# EAGLE design MKRZero_V5.0 (EAGLE 9.3.0)

## Sheet 1 of 2
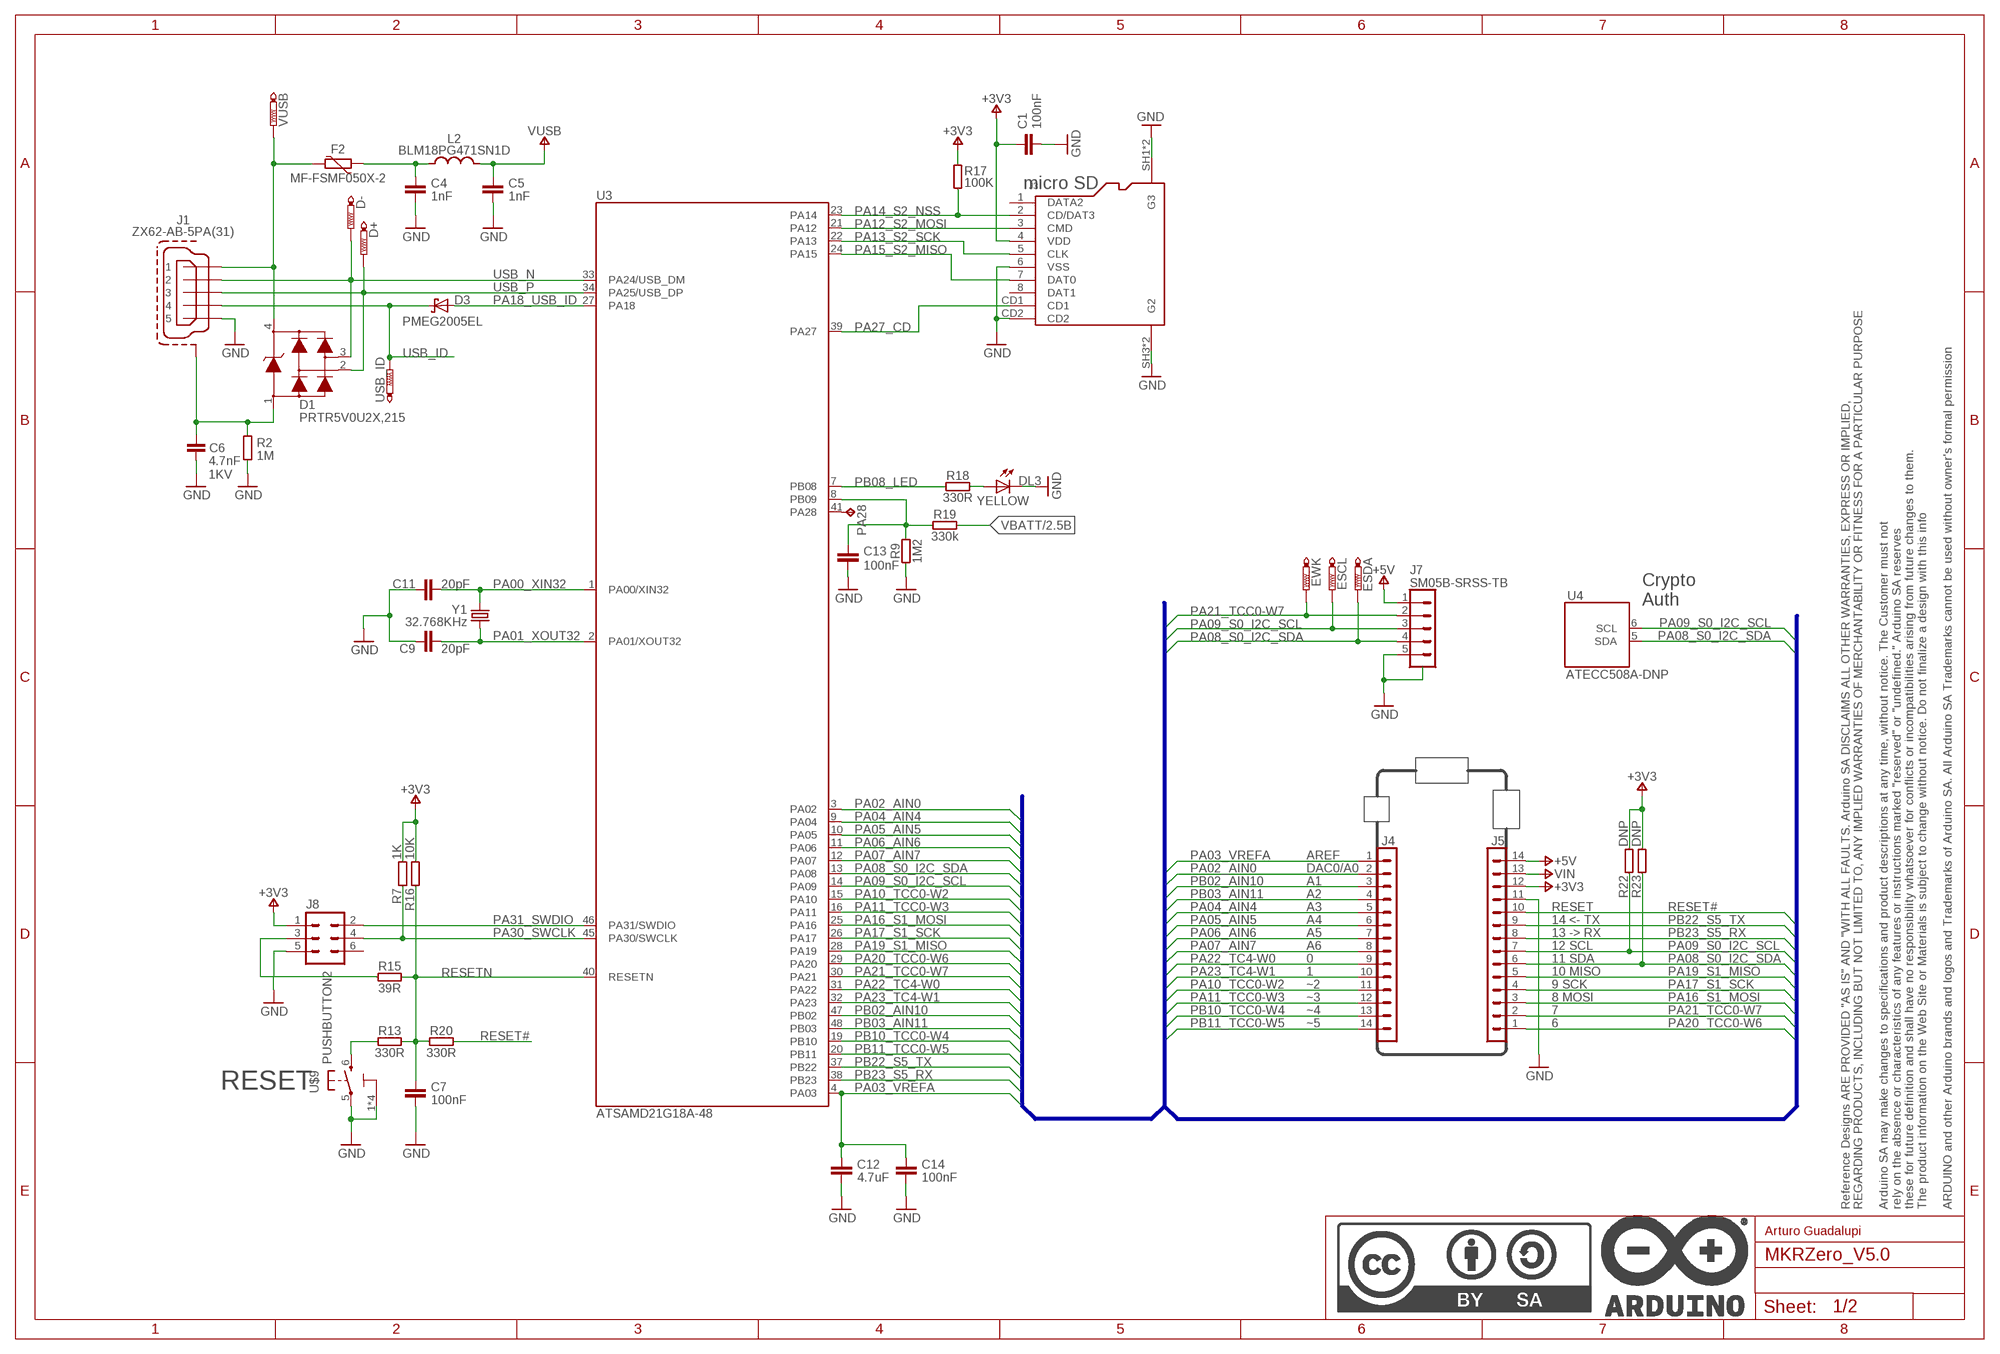
[diagram p0: schematic, sheet 1]

### Parts
C1  100nF  C-100NF-0402  [0402-1005X55N]
C4  1nF  C-10NF-0402  [0402-1005X55N]
C5  1nF  C-100NF-0402  [0402-1005X55N]
C6  4.7nF  CAPACITORS-0805  [C0805]
C7  100nF  C-100NF-0402  [0402-1005X55N]
C9  20pF  C-20PF-0402  [0402-1005X55N]
C11  20pF  C-20PF-0402  [0402-1005X55N]
C12  4.7uF  C-4.7UF-0402  [0402-1005X55N]
C13  100nF  C-100NF-0402  [0402-1005X55N]
C14  100nF  C-100NF-0402  [0402-1005X55N]
D1  PRTR5V0U2X,215  [SOT190P230X110-4N]
D3  PMEG2005EL  [SODFL1008X40N-882D]
D+  PTR1B1,27  [B1,27]
D-  PTR1B1,27  [B1,27]
DL3  YELLOW  LED-GREEN-0603  [LEDC1608X80N-AK]
ESCL  PTR1B1,27  [B1,27]
ESDA  PTR1B1,27  [B1,27]
EWK  PTR1B1,27  [B1,27]
F2  MF-FSMF050X-2  [0603-F1608X100N]
FRAME1  DNP  A3-FRAME  [FRAME]
J1  ZX62-AB-5PA(31)  ZX62AB-5PA(11)  [USBMICRO-ZX62-AB-5PA]
J3  AMPHENOL_114-00841-68  [AMPHENOL_114-00841-68]
J4  DNP  STRIP-14  [STRIP-14-MODULI-A11]
J5  DNP  STRIP-14  [STRIP-14-MODULI-A11]
J7  SM05B-SRSS-TB  [SM05B-SRSS-TB]
J8  2X3_SMD_MALE  [2X3_SMT]
L2  BLM18PG471SN1D  [0603-1608X90N]
PA28  TPB2,54  [B2,54]
R2  1M  R-1M-0402  [0402-1005X55N]
R7  1K  R-1K-0402  [0402-1005X55N]
R9  1M2  R-330R-0402  [0402-1005X55N]
R13  330R  R-330R-0402  [0402-1005X55N]
R15  39R  R-39R-0402  [0402-1005X55N]
R16  10K  R-10K-0402  [0402-1005X55N]
R17  100K  R-100K-0402  [0402-1005X55N]
R18  330R  R-330R-0402  [0402-1005X55N]
R19  330k  R-330R-0402  [0402-1005X55N]
R20  330R  R-330R-0402  [0402-1005X55N]
R22  DNP  R-4K7-0402  [0402-1005X55N]
R23  DNP  R-4K7-0402  [0402-1005X55N]
U3  ATSAMD21G18A-48  [QFN50P700X700X90-49XN-EPSQ515]
U4  ATECC508A-DNP  ATECC508A-MAHDA-T  [SON50P300X200X60-9N-EP160X140]
U$9  PUSHBUTTON2  [C&K_PTS820_NOPEGS]
USB_ID  PTR1B1,27  [B1,27]
VUSB  PTR1B1,27  [B1,27]
Y1  32.768KHz  ABS07-32.768KHZ-T  [QUARZO-ABS07]

### Nets
+3V3: C1.1 J3.4(VDD) J5.12 J8.1 R7.2 R16.2 R17.2 R22.2 R23.2 ; also sheet 2
+5V: J5.14 J7.1 ; also sheet 2
GND: C1.2 C4.2 C5.2 C6.2 C7.2 C9.1 C11.1 C12.2 C13.2 C14.2 DL3.C J1.5 J3.6(VSS) J3.CD2 J3.SH1(G3) J3.SH2(G3) J3.SH3(G2) J3.SH4(G2) J5.11 J7.5 J7.SH1(SH) J7.SH2(SH) J8.5 R2.1 R9.1 U$9.1 U$9.2 U$9.3 U$9.4 U$9.5 ; also sheet 2
N17650912: D1.4 F2.2 J1.1 VUSB.PP(TP)
N17658775: R13.1 U$9.6
N$1: C6.1 D1.1 J1.6(SH) J1.7(SH) J1.8(SH) J1.9(SH) J1.10(SH) J1.11(SH) R2.2
N$2: C4.1 F2.1 L2.1
N$4: J8.3 R15.1
N$5: PA28.PP(TP) U3.41(PA28)
N$6: C13.1 R9.2 R19.1 U3.8(PB09)
N$7: DL3.A R18.2
PA00_XIN32: C11.2 U3.1(PA00/XIN32) Y1.2
PA01_XOUT32: C9.2 U3.2(PA01/XOUT32) Y1.1
PA02_AIN0: J4.2 U3.3(PA02)
PA03_VREFA: C12.1 C14.1 J4.1 U3.4(PA03)
PA04_AIN4: J4.5 U3.9(PA04)
PA05_AIN5: J4.6 U3.10(PA05)
PA06_AIN6: J4.7 U3.11(PA06)
PA07_AIN7: J4.8 U3.12(PA07)
PA08_S0_I2C_SDA: ESDA.PP(TP) J5.6 J7.4 R23.1 U3.13(PA08) U4.5(SDA)
PA09_S0_I2C_SCL: ESCL.PP(TP) J5.7 J7.3 R22.1 U3.14(PA09) U4.6(SCL)
PA10_TCC0-W2: J4.11 U3.15(PA10)
PA11_TCC0-W3: J4.12 U3.16(PA11)
PA12_S2_MOSI: J3.3(CMD) U3.21(PA12)
PA13_S2_SCK: J3.5(CLK) U3.22(PA13)
PA14_S2_NSS: J3.2(CD/DAT3) R17.1 U3.23(PA14)
PA15_S2_MISO: J3.7(DAT0) U3.24(PA15)
PA16_S1_MOSI: J5.3 U3.25(PA16)
PA17_S1_SCK: J5.4 U3.26(PA17)
PA18_USB_ID: D3.A U3.27(PA18)
PA19_S1_MISO: J5.5 U3.28(PA19)
PA20_TCC0-W6: J5.1 U3.29(PA20)
PA21_TCC0-W7: EWK.PP(TP) J5.2 J7.2 U3.30(PA21)
PA22_TC4-W0: J4.9 U3.31(PA22)
PA23_TC4-W1: J4.10 U3.32(PA23)
PA27_CD: J3.CD1 U3.39(PA27)
PA30_SWCLK: J8.4 R7.1 U3.45(PA30/SWCLK)
PA31_SWDIO: J8.2 U3.46(PA31/SWDIO)
PB02_AIN10: J4.3 U3.47(PB02)
PB03_AIN11: J4.4 U3.48(PB03)
PB08_LED: R18.1 U3.7(PB08)
PB10_TCC0-W4: J4.13 U3.19(PB10)
PB11_TCC0-W5: J4.14 U3.20(PB11)
PB22_S5_TX: J5.9 U3.37(PB22)
PB23_S5_RX: J5.8 U3.38(PB23)
RESET#: J5.10 R20.2
RESETN: C7.1 R13.2 R15.2 R16.1 R20.1 U3.40(RESETN)
USB_ID: D3.C J1.4 USB_ID.PP(TP) ; also sheet 2
USB_N: D1.3 D-.PP(TP) J1.2 U3.33(PA24/USB_DM)
USB_P: D1.2 D+.PP(TP) J1.3 U3.34(PA25/USB_DP)
VBATT: R19.2 ; also sheet 2
VIN: J5.13 ; also sheet 2
VUSB: C5.1 L2.2 ; also sheet 2
Unconnected: J3.1(DATA2) J3.8(DAT1) J8.6

### Buses
PA03_VREFA,PA02_AIN0,PB02_AIN10,PB03_AIN11,PA04_AIN4,PA05_AIN5,PA06_AIN6,PA07_AIN7,PA22_TC4-W0,PA23_TC4-W1,PA10_TCC0-W2,PA11_TCC0-W3,PB10_TCC0-W4,PB11_TCC0-W5,PA20_TCC0-W6,PA21_TCC0-W7,PA16_S1_MOSI,PA17_S1_SCK,PA19_S1_MISO,PA08_S0_I2C_SDA,PA09_S0_I2C_SCL,PB23_S5_RX,PB22_S5_TX,RESET#

### Notes on the sheet
- micro SD
- Crypto
  Auth
- AREF
- DAC0/A0
- A1
- A2
- A3 | RESET
- A4 | 14 <- TX
- A5 | 13 -> RX
- A6 | 12 SCL
- 0 | 11 SDA
- 1 | 10 MISO
- ~2 | 9 SCK
- ~3 | 8 MOSI
- ~4 | 7
- ~5 | 6
- RESET
- Arturo Guadalupi

## Sheet 2 of 2
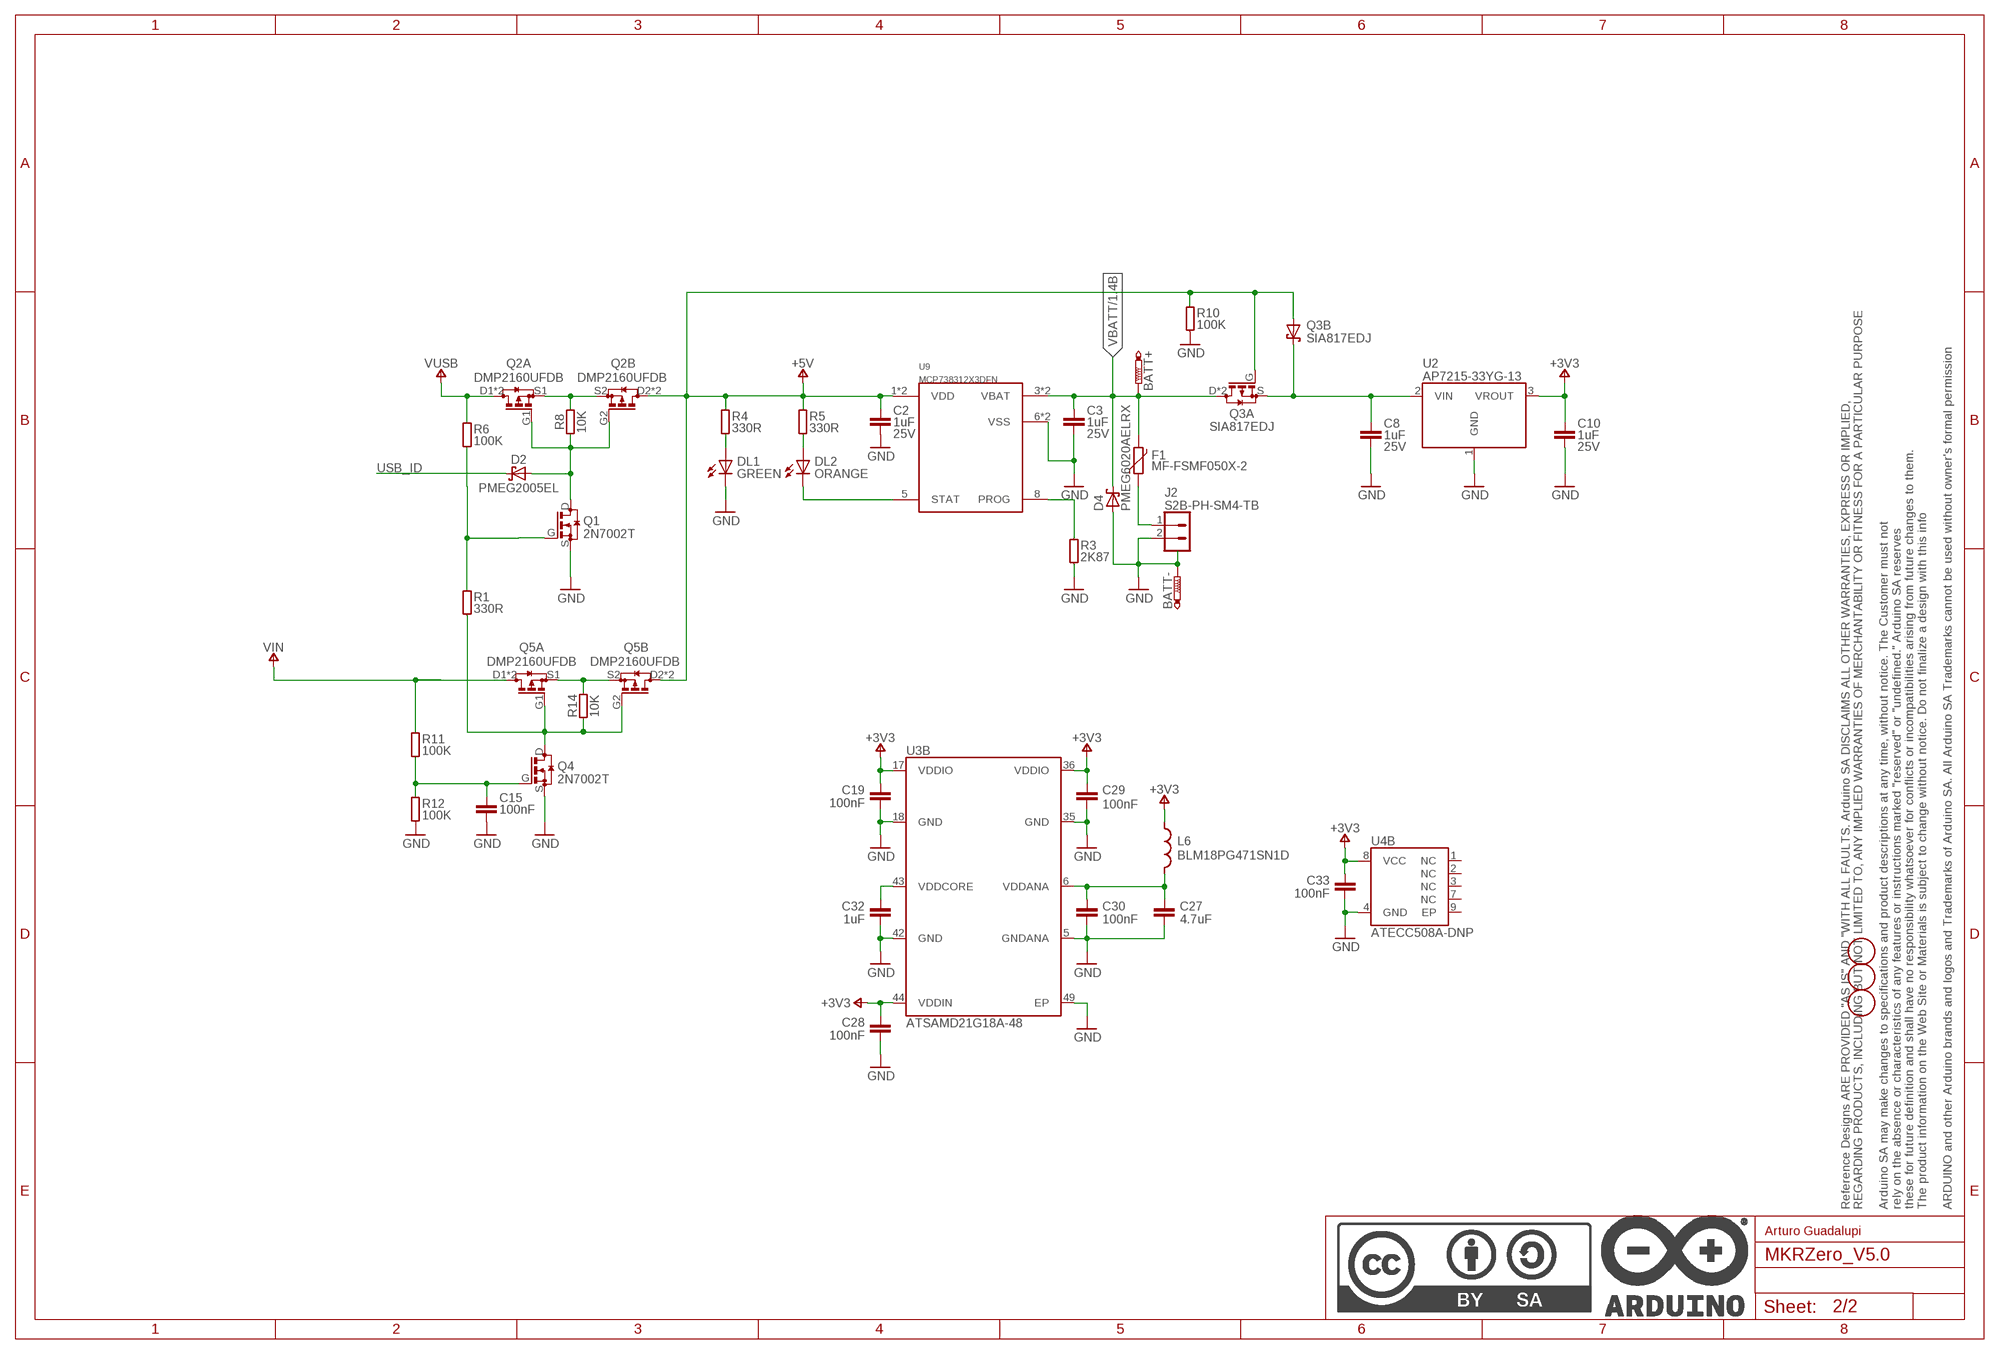
[diagram p1: schematic, sheet 2]

### Parts
BATT+  PTR1B1,27  [B1,27]
BATT-  PTR1B1,27  [B1,27]
C2  1uF  C-1UF-0402  [0402-1005X55N]
C3  1uF  C-1UF-0402  [0402-1005X55N]
C8  1uF  C-1UF-0402  [0402-1005X55N]
C10  1uF  C-1UF-0402  [0402-1005X55N]
C15  100nF  C-1UF-0402  [0402-1005X55N]
C19  100nF  C-100NF-0402  [0402-1005X55N]
C27  4.7uF  C-4.7UF-0402  [0402-1005X55N]
C28  100nF  C-100NF-0402  [0402-1005X55N]
C29  100nF  C-100NF-0402  [0402-1005X55N]
C30  100nF  C-100NF-0402  [0402-1005X55N]
C32  1uF  C-1UF-0402  [0402-1005X55N]
C33  100nF  C-100NF-0402  [0402-1005X55N]
D2  PMEG2005EL  [SODFL1008X40N-882D]
D4  PMEG6020AELRX  D_SCHOTTKYSO123  [SMA_DO123]
DL1  GREEN  LED-GREEN-0603  [LEDC1608X80N-AK]
DL2  ORANGE  LED-ORANGE-0603  [LEDC1608X80N-AK]
F1  MF-FSMF050X-2  [0603-F1608X100N]
FD1  FIDUCIALMOUNT  [FIDUCIAL-MOUNT]
FD2  FIDUCIALMOUNT  [FIDUCIAL-MOUNT]
FD3  FIDUCIALMOUNT  [FIDUCIAL-MOUNT]
FRAME2  DNP  A3-FRAME  [FRAME]
J2  S2B-PH-SM4-TB  [JST-S2B-PH-SM4-TB]
L6  BLM18PG471SN1D  [0603-1608X90N]
Q1  2N7002T  [SOTFL50P160X78-3]
Q2  DMP2160UFDB  [SON65P200X200X60-8N-DM]
Q3  SIA817EDJ  [SON65P205X205X75-8N-MWSD]
Q4  2N7002T  [SOTFL50P160X78-3]
Q5  DMP2160UFDB  [SON65P200X200X60-8N-DM]
R1  330R  R-330R-0402  [0402-1005X55N]
R3  2K87  R-2K87-0402  [0402-1005X55N]
R4  330R  R-330R-0402  [0402-1005X55N]
R5  330R  R-330R-0402  [0402-1005X55N]
R6  100K  R-100K-0402  [0402-1005X55N]
R8  10K  R-10K-0402  [0402-1005X55N]
R10  100K  R-100K-0402  [0402-1005X55N]
R11  100K  R-100K-0402  [0402-1005X55N]
R12  100K  R-100K-0402  [0402-1005X55N]
R14  10K  R-10K-0402  [0402-1005X55N]
U2  AP7215-33YG-13  [SOT150P400X160-3N]
U9  MCP738312X3DFN  [2X3DFN]

### Nets
+3V3: C10.1 C19.1 C28.1 C29.1 C33.1 L6.1 U2.3(VROUT) U3.17(VDDIO) U3.36(VDDIO) U3.44(VDDIN) U4.8(VCC) ; also sheet 1
+5V: C2.1 Q2.D2'(B:D) Q2.D2(B:D) Q3.A(B:A) Q3.G(A:G) Q5.D2'(B:D) Q5.D2(B:D) R4.2 R5.2 R10.2 U9.1(VDD) U9.2(VDD) ; also sheet 1
GND: BATT-.PP(TP) C2.2 C3.2 C8.2 C10.2 C15.2 C19.2 C27.2 C28.2 C29.2 C30.2 C32.2 C33.2 D4.A DL1.C J2.2 J2.3(SH) J2.4(SH) Q1.S Q4.S R3.1 R10.1 R12.1 U2.1(GND) U3.5(GNDANA) U3.18(GND) U3.35(GND) U3.42(GND) U3.49(EP) U4.4(GND) U9.6(VSS) U9.PAD(VSS) ; also sheet 1
N17690335: Q2.S1(A:S) Q2.S2(B:S) R8.2
N17690346: D2.A Q1.D Q2.G1(A:G) Q2.G2(B:G) R8.1
N17690381: Q1.G R1.2 R6.1
N17690821: Q5.S1(A:S) Q5.S2(B:S) R14.2
N17690840: Q4.D Q5.G1(A:G) Q5.G2(B:G) R1.1 R14.1
N17690878: C15.1 Q4.G R11.1 R12.2
N17792230: R3.2 U9.8(PROG)
N17798864: DL2.A R5.1
N17834267: DL1.A R4.1
N17852357: C27.1 C30.1 L6.2 U3.6(VDDANA)
N17852431: C32.1 U3.43(VDDCORE)
N$3: F1.1 J2.1
STAT: DL2.C U9.5(STAT)
USB_ID: D2.C ; also sheet 1
VBATT: BATT+.PP(TP) C3.1 D4.C F1.2 Q3.D2(A:D) Q3.D(A:D) U9.3(VBAT) U9.4(VBAT) ; also sheet 1
VIN: Q5.D1'(A:D) Q5.D1(A:D) R11.2 ; also sheet 1
VLDO: C8.1 Q3.K2(B:C) Q3.K(B:C) Q3.S(A:S) U2.2(VIN)
VUSB: Q2.D1'(A:D) Q2.D1(A:D) R6.2 ; also sheet 1
Unconnected: U4.1(NC) U4.2(NC) U4.3(NC) U4.7(NC) U4.9(EP)

### Notes on the sheet
- Arturo Guadalupi

## Library data of the parts
BATT+ BATT- D+ D- ESCL ESDA EWK USB_ID VUSB = testpad:PTR1: TEST PIN
C1 C5 C7 C13 C14 C19 C28-C30 C33 = MK1_Zero:C: Capacitor; DESCR: CAP CER 0.1UF 50V 10% X5R 0402; MF: TDK; MPN: C1005X5R1H104K050BB
C2 C3 C8 C10 C15 = MK1_Zero:C: Capacitor; DESCR: CAP CER 1UF 25V 10% X5R 0402; MF: Murata; MPN: GRM155R61E105KA12D; VOLTAGE: 25V
C4 = MK1_Zero:C: Capacitor; DESCR: CAP CER 10NF 50V 10% X7R 0402; MF: Murata; MPN: GRM155R71H103KA88J
C6 = Arduino-rcl:CAPACITORS: Capacitors ...4.7uF @ 6.3V -> 0402 ...10uF @ 16V -> 0603 ...22uF @ 25V -> 0805; VOLTAGE: 1KV
C9 C11 = MK1_Zero:C: Capacitor; DESCR: CAP CER 20PF 50V 5% NP0 0402; MF: Kemet; MPN: CBR04C200J5GAC
C12 C27 = MK1_Zero:C: Capacitor; DESCR: CAP CER 4.7UF 6.3V 20% X5R 0402; MF: Murata; MPN: GRM155R60J475ME47D
C32 = MK1_Zero:C: Capacitor; DESCR: CAP CER 1UF 25V 10% X5R 0402; MF: Murata; MPN: GRM155R61E105KA12D
D1 = MK1_Zero:PRTR5V0U2X,215; DESCR: TVS DIODE 5.5VWM SOT143B; MF: NXP; MPN: PRTR5V0U2X,215
D2 D3 = MK1_Zero:PMEG2005EL: DIODE SCHOTTKY 20V 500MA SOD882; DESCR: DIODE SCHOTTKY 20V 500MA SOD882; MF: NXP; MPN: PMEG2005EL,315
D4 = Arduino-diodes:D_SCHOTTKY: Schottky Diodes
DL1 DL3 = MK1_Zero:LED: LED; DESCR: LED GREEN DIFFUSED 0603 SMD; MF: Avago; MPN: HSMG-C190
DL2 = MK1_Zero:LED: LED; DESCR: LED ORANGE DIFFUSED 0603 SMD; MF: Avago; MPN: HSMD-C190
F1 F2 = MK1_Zero:MF-FSMF050X-2: FUSE PTC RESET 500MA SMD 0603; DESCR: FUSE PTC RESET 500MA SMD 0603; MF: Bourns Inc; MPN: MF-FSMF050X-2
FD1-FD3 = Arduino-utility:FIDUCIALMOUNT
FRAME1 FRAME2 = Arduino-utility:A3-FRAME; CODE-ARDUINO: DNP; DATASHEET: DNP; DISTRIBUTOR-LINK: DNP; DISTRIBUTOR-PN: DNP; MANUFACTURER: DNP; MANUFACTURER-PN: DNP; NOTE: DNP
J1 = MK1_Zero:ZX62AB-5PA(11)
J2 = MK1_Zero:S2B-PH-SM4-TB: CONN HEADER PH SIDE 2POS 2MM SMD; DESCR: CONN HEADER PH SIDE 2POS 2MM SMD; MF: JST; MPN: S2B-PH-SM4-TB(LF)(SN)
J3 = Arduino-connectors:AMPHENOL_114-00841-68
J4 J5 = MK1_Zero:STRIP-14
J7 = MK1_Zero:SM05B-SRSS-TB: CONN HEADER SH 5POS SIDE 1MM TIN Datasheet <http://www.jst-mfg.com/product/pdf/eng/eSH.pdf>; DESCR: CONN HEADER SH 5POS SIDE 1MM TIN; MF: JST; MPN: SM05B-SRSS-TB
J8 = MK1_Zero:2X3_SMD_MALE
L2 L6 = MK1_Zero:BLM18PG471SN1D: FERRITE CHIP 470 OHM 1000MA 0603
PA28 = testpad:TP: Test pad
Q1 Q4 = MK1_Zero:2N7002T: MOSFET N-CH 60V 115MA SOT-523F; DESCR: MOSFET N-CH 60V 115MA SOT-523F; MF: Fairchild; MPN: 2N7002T
Q2 Q5 = MK1_Zero:DMP2160UFDB: MOSFET 2P-CH 20V 3.8A 6UDFN; DESCR: MOSFET 2P-CH 20V 3.8A 6UDFN; MF: Diodes Inc; MPN: DMP2160UFDB-7
Q3 = MK1_Zero:SIA817EDJ: MOSFET P-CH 30V 4.5A SC-70-6; DESCR: MOSFET P-CH 30V 4.5A SC-70-6; MF: Vishay; MPN: SIA817EDJ-T1-GE3
R1 R4 R5 R9 R13 R18-R20 = MK1_Zero:R: Resistor; DESCR: RES 330 OHM 1/16W 1% 0402 SMD; MF: Yageo; MPN: RC0402FR-07330RL
R2 = MK1_Zero:R: Resistor; DESCR: RES 1M OHM 1/16W 1% 0402; MF: Yageo; MPN: RC0402FR-071ML
R3 = MK1_Zero:R: Resistor; DESCR: RES SMD 2.87K OHM 1% 1/16W 0402; MF: Yageo; MPN: RC0402FR-072K87L
R6 R10-R12 R17 = MK1_Zero:R: Resistor; DESCR: RES 100K OHM 1/16W 1% 0402 SMD; MF: Yageo; MPN: RC0402FR-07100KL
R7 = MK1_Zero:R: Resistor; DESCR: RES SMD 1K OHM 1% 1/16W 0402; MF: Yageo; MPN: RC0402FR-071KL
R8 R14 R16 = MK1_Zero:R: Resistor; DESCR: RES SMD 10K OHM 1% 1/16W 0402; MF: Yageo; MPN: RC0402FR-0710KL
R15 = MK1_Zero:R: Resistor; DESCR: RES 39.0 OHM 1/16W 1% 0402 SMD; MF: Yageo; MPN: RC0402FR-0739RL
R22 R23 = MK1_Zero:R: Resistor; DESCR: RES 4.7K OHM 1/16W 1% 0402 SMD; MF: Yageo; MPN: RC0402FR-074K7L
U2 = MK1_Zero:AP7215-33YG-13: IC REG LDO 3.3V 0.6A SOT89-3 Datasheet <http://www.diodes.com/_files/datasheets/AP7215.pdf>; DESCR: IC REG LDO 3.3V 0.6A SOT89-3; MF: Diodes Inc; MPN: AP7215-33YG-13
U3 = MK1_Zero:ATSAMD21G18A-48: IC MCU 32BIT 256KB FLASH 48QFN Datasheet (Summary) <http://www.atmel.com/Images/Atmel-42181-SAM-D21_Summary.pdf> Datasheet (Complete) <http://www.atmel.com/Images/Atmel-42181-SAM-D21_Datasheet.pdf>; DESCR: IC MCU 32BIT 256KB FLASH 48QFN; MF: Atmel; MPN: ATSAMD21E18A-MU
U4 = MK1_Zero:ATECC508A-MAHDA-T: IC CRYPTO ECC 8KB 8-UDFN I2C; DESCR: IC CRYPTO ECC 8KB 8-UDFN I2C; MF: Atmel; MPN: ATECC508A-MAHDA-T
U9 = Arduino-ICs:MCP73831
U$9 = Arduino-pushbuttons:PUSHBUTTON2: TS42 Dongnan Electronics Tact switch VDC 12V - 50mA
Y1 = MK1_Zero:ABS07-32.768KHZ-T; DESCR: CRYSTAL 32.768KHZ 12.5PF SMD 3.2x1.5mm; MF: Abracon; MPN: ABS07-32.768KHZ-T

## Net classes
0 default: width 0.25 mm, drill 0.25 mm

## Board
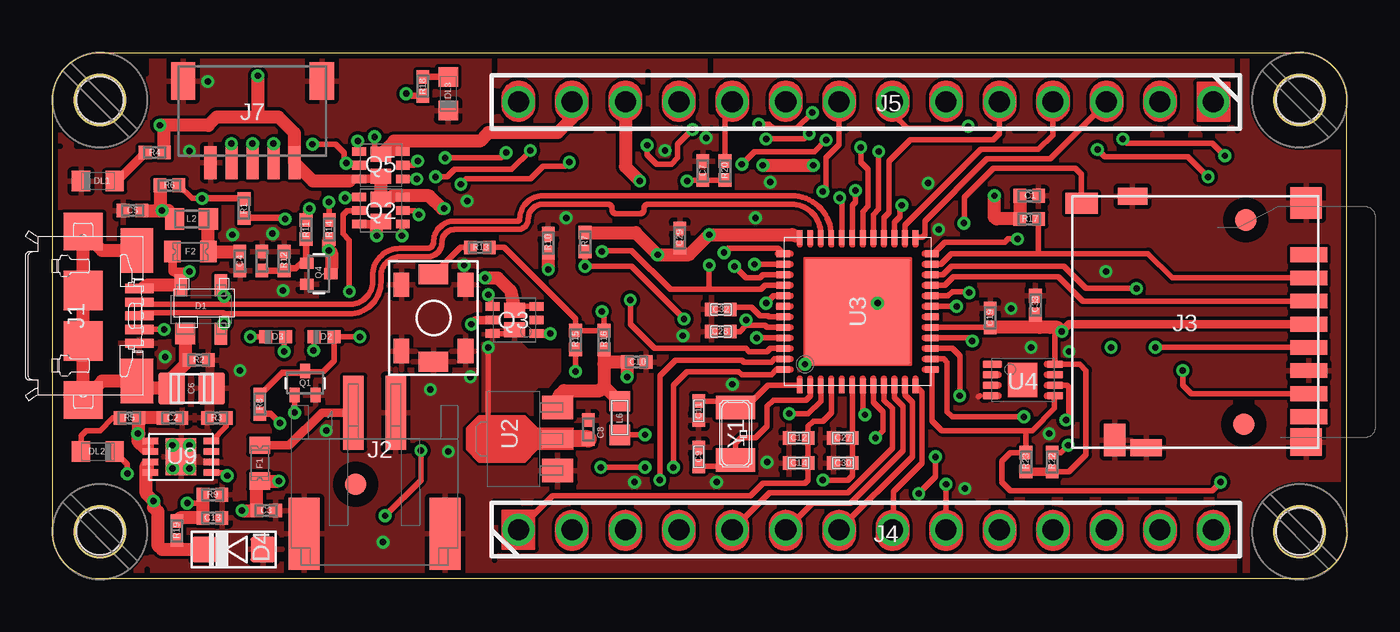
[diagram p2: board, top side]
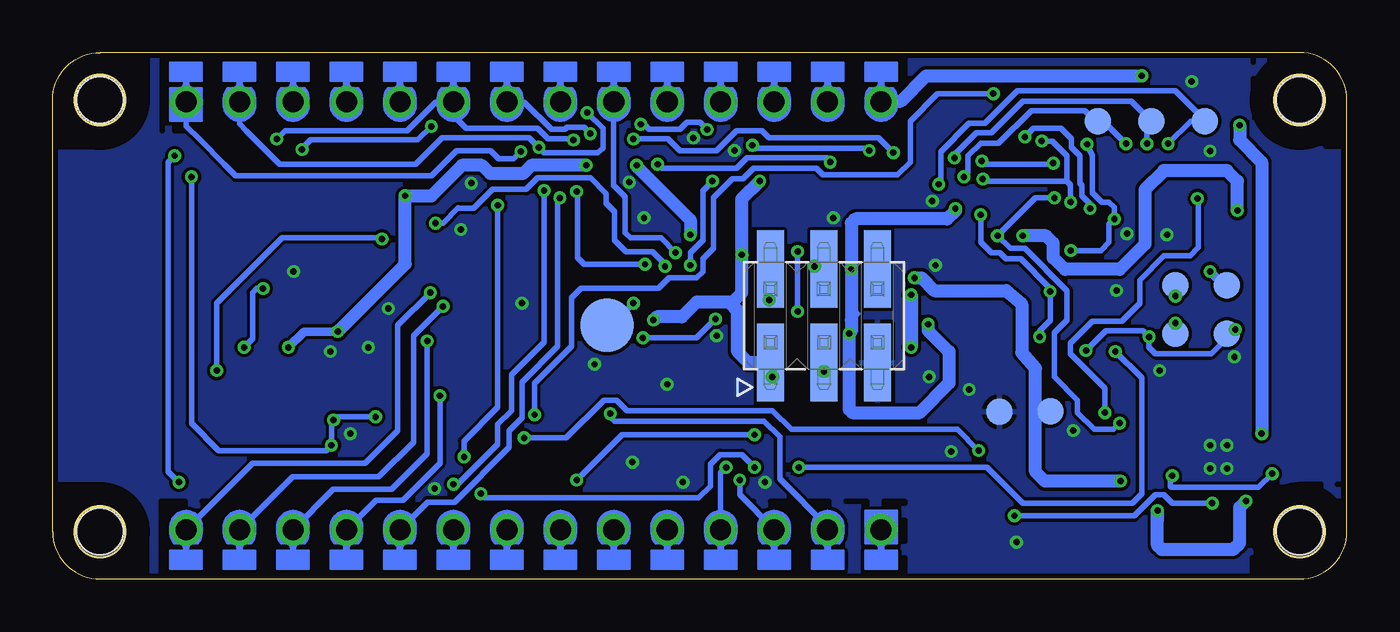
[diagram p3: board, bottom side, seen from below]

Size 61.5 x 25 mm. Coordinates in mm from the lower left corner, seen from the top.
Outline: 59.25,0 2.25,0 arc-90 0,2.25 0,22.75 arc-90 2.25,25 59.25,25 arc-90 61.5,22.75 61.5,2.25 arc-90 59.25,0
Copper layers (1*16): Top 0.035mm / dielectric 1.5mm / Bottom 0.035mm
Design rules "SeeedStudio_2layers *": minimum track width 6mil, minimum drill 12mil, track to track 6mil, track to pad 6mil, pad to pad 6mil, via to via 6mil, smd to smd 0mil, copper to edge 10mil, drill to drill 10mil, minimum pad ring 10mil, minimum via ring 6mil, stop-mask expansion 2mil, vias tented up to drill 100mil, thermal gap 8mil
Holes 2.2 mm at 2.25,2.25 59.25,2.25 59.25,22.75 2.25,22.75
tRestrict: area 0,0 to 4.5,4.5; area 0,20.5 to 4.5,25; area 57,20.5 to 61.5,25; area 57,0 to 61.5,4.5; 128 lines
bRestrict: area 0,0 to 4.5,4.5; area 0,20.5 to 4.5,25; area 57,0 to 61.5,4.5; area 57,20.5 to 61.5,25; 113 lines

### Footprints (pad centres in the part's own frame; a part is rotated, then mirrored left to right if it is on the bottom)
B1,27 = smd 1.27 x 1.27: PP 0,0
0402-1005X55N = smd 0.62 x 0.62: 1 -0.45,0; 2 0.45,0
C0805 = smd 1.5 x 1.25: 1 0,0.95; 2 0,-0.95
SOT190P230X110-4N = smd 1 x 1: 1 -1.15,0.75 | smd 1 x 0.6: 2 -1.15,-0.95; 3 1.15,-0.95; 4 1.15,0.95
SODFL1008X40N-882D = smd 0.65 x 0.6: A 0.475,0; C -0.475,0
SMA_DO123 = smd 1.2 x 1.2: A 0,-1.4; C 0,1.4
LEDC1608X80N-AK = smd 0.9 x 0.95: A 0.8,0; C -0.8,0
0603-F1608X100N = smd 0.8 x 1: 1 -0.85,0; 2 0.85,0
FIDUCIAL-MOUNT = smd 1.016 x 1.016: P$1 0,0
USBMICRO-ZX62-AB-5PA = smd 0.4 x 1.35: 1 -1.3,3.025; 2 -0.65,3.025; 3 0,3.025; 4 0.65,3.025; 5 1.3,3.025 | smd 2.1 x 1.6: 6 3.1,2.9; 11 -3.1,2.9 | smd 1.8 x 1.9: 7 4,0.35; 10 -4,0.35 | smd 1.9 x 1.9: 8 1.2,0.35; 9 -1.2,0.35
JST-S2B-PH-SM4-TB = smd 1 x 3.5: 1 -1,2.95; 2 1,2.95 | smd 1.5 x 3.4: 3 3.35,-2.8; 4 -3.35,-2.8
AMPHENOL_114-00841-68 = smd 0.7 x 1.75: 1 3.2,-5.888; 2 2.1,-5.888; 3 1,-5.888; 4 -0.1,-5.888; 5 -1.2,-5.888; 6 -2.3,-5.888; 7 -3.4,-5.888; 8 -4.5,-5.888 | smd 1 x 1.55: CD1 5.65,4.912 | smd 1.55 x 1: CD2 -5.602,3.337 | smd 1.3 x 1.5: SH1 -5.7,-5.76 | smd 1.5 x 1.5: SH2 5.65,-5.76 | smd 0.8 x 1.4: SH3 5.975,2.487 | smd 0.8 x 1.5: SH4 -5.975,1.837
STRIP-14-MODULI-A11 = drill 1: 1 0,0; 2 2.54,0; 3 5.08,0; 4 7.62,0; 5 10.16,0; 6 12.7,0; 7 15.24,0; 8 17.78,0; 9 20.32,0; 10 22.86,0; 11 25.4,0; 12 27.94,0; 13 30.48,0; 14 33.02,0
SM05B-SRSS-TB = smd 0.6 x 1.55: 1 -2,2.425; 2 -1,2.425; 3 0,2.425; 4 1,2.425; 5 2,2.425 | smd 1.2 x 1.8: SH1 -3.3,-1.45; SH2 3.3,-1.45
2X3_SMT = smd 1.27 x 3.683: 1 -2.54,-2.223; 2 -2.54,2.223; 3 0,-2.223; 4 0,2.223; 5 2.54,-2.223; 6 2.54,2.223
0603-1608X90N = smd 0.95 x 1: 1 -0.8,0; 2 0.8,0
B2,54 = smd 2.54 x 2.54: PP 0,0
SOTFL50P160X78-3 = smd 0.5 x 0.66: D 0,0.57; G -0.5,-0.57; S 0.5,-0.57
SON65P200X200X60-8N-DM = smd 0.67 x 0.37: D1 1.04,0.65; D2 -1.04,-0.65; G1 -1.04,0; G2 1.04,0; S1 -1.04,0.65; S2 1.04,-0.65 | smd 1 x 0.7: D1' 0,0.525; D2' 0,-0.525
SON65P205X205X75-8N-MWSD = smd 0.67 x 0.37: A 1.04,-0.65; D 1.04,0.65; G -1.04,0; K -1.04,-0.65; NC 1.04,0; S -1.04,0.65 | smd 1 x 0.7: D2 0,0.467; K2 0,-0.467
SOT150P400X160-3N = smd 1.1 x 1.5: 1 -1.5,-1.8; 3 1.5,-1.8 | smd 0.8 x 1.5: 2 0,-1.8
QFN50P700X700X90-49XN-EPSQ515 = smd 0.65 x 0.28: 1 -3.525,2.75; 2 -3.525,2.25; 3 -3.525,1.75; 4 -3.525,1.25; 5 -3.525,0.75; 6 -3.525,0.25; 7 -3.525,-0.25; 8 -3.525,-0.75; 9 -3.525,-1.25; 10 -3.525,-1.75; 11 -3.525,-2.25; 12 -3.525,-2.75; 25 3.525,-2.75; 26 3.525,-2.25; 27 3.525,-1.75; 28 3.525,-1.25; 29 3.525,-0.75; 30 3.525,-0.25; 31 3.525,0.25; 32 3.525,0.75; 33 3.525,1.25; 34 3.525,1.75; 35 3.525,2.25; 36 3.525,2.75 | smd 0.28 x 0.65: 13 -2.75,-3.525; 14 -2.25,-3.525; 15 -1.75,-3.525; 16 -1.25,-3.525; 17 -0.75,-3.525; 18 -0.25,-3.525; 19 0.25,-3.525; 20 0.75,-3.525; 21 1.25,-3.525; 22 1.75,-3.525; 23 2.25,-3.525; 24 2.75,-3.525; 37 2.75,3.525; 38 2.25,3.525; 39 1.75,3.525; 40 1.25,3.525; 41 0.75,3.525; 42 0.25,3.525; 43 -0.25,3.525; 44 -0.75,3.525; 45 -1.25,3.525; 46 -1.75,3.525; 47 -2.25,3.525; 48 -2.75,3.525 | smd 5 x 5: 49 0,0
SON50P300X200X60-9N-EP160X140 = smd 0.85 x 0.3: 1 -1.45,0.75 | smd 0.7 x 0.3: 2 -1.525,0.25; 3 -1.525,-0.25; 4 -1.525,-0.75; 5 1.525,-0.75; 6 1.525,-0.25; 7 1.525,0.25; 8 1.525,0.75 | smd 1.4 x 1.6: 9 0,0
2X3DFN = smd 0.3 x 0.75: 1 -0.75,-1.45; 2 -0.25,-1.45; 3 0.25,-1.45; 4 0.75,-1.45; 5 0.75,1.45; 6 0.25,1.45; 7 -0.25,1.45; 8 -0.75,1.45 | smd 1.75 x 1.45: PAD 0,0
C&K_PTS820_NOPEGS = smd 1.15 x 0.75: 1 -1.575,1.525; 2 -1.575,-1.525; 3 1.575,1.525; 4 1.575,-1.525 | smd 0.95 x 1.4: 5 -2.075,0; 6 2.075,0
QUARZO-ABS07 = smd 1.1 x 1.9: 1 -1.25,0; 2 1.25,0

### Placement (x,y rotation side)
BATT+  14.1,7.96 0 bottom
BATT-  16.5,7.95 0 bottom
C1  46.4,18.2 0 top
C2  5.7,7.65 0 top
C3  10.15,3.25 0 top
C4  8.9,15.1 270 top
C5  3.8,17.5 180 top
C6  6.6,9.05 90 top
C7  30.9,19.4 90 top
C8  25.45,7.1 90 top
C9  30.7,5.8 270 top
C10  27.75,10.3 0 top
C11  30.7,8 90 top
C12  35.45,6.7 180 top
C13  7.6,2.9 0 top
C14  35.45,5.5 180 top
C15  9.95,15.1 90 top
C19  44.55,12.4 90 top
C27  37.55,6.7 180 top
C28  31.75,11.75 180 top
C29  29.8,16.2 90 top
C30  37.55,5.5 180 top
C32  31.75,12.8 180 top
C33  46.7,13 90 top
D1  7.05,12.8 90 top
D2  12.9,11.5 0 top
D3  10.6,11.5 0 top
D4  8.6,1.4 90 top
D+  8.15,11.65 0 bottom
D-  8.15,13.95 0 bottom
DL1  2.15,18.9 0 top
DL2  2.15,6.05 180 top
DL3  18.8,23.05 90 top
ESCL  9.29,21.75 0 bottom
ESDA  6.75,21.75 0 bottom
EWK  11.83,21.75 0 bottom
F1  9.85,5.5 270 top
F2  6.55,15.55 180 top
FD1  56.6,7.35 90 top
FD2  56.7,17.05 90 top
FD3  14.4,4.5 0 top
FRAME1  -2.3,-25.85 0 top  (outside the outline)
FRAME2  -1.8,-21.7 0 top  (outside the outline)
J1  1.1,12.5 270 top
J2  15.3,4.95 0 top
J3  53.8,12.2 90 top
J4  22.13,2.34 0 top
J5  55.15,22.66 180 top
J7  9.5,22.2 180 top
J8  24.85,12.5 0 bottom
L2  6.6,17.1 180 top
L6  26.95,7.64 270 top
PA28  35.15,12.05 0 bottom
Q1  12,9.3 0 top
Q2  15.6,17.5 180 top
Q3  21.95,12.3 0 top
Q4  12.65,14.5 270 top
Q5  15.6,19.65 0 top
R1  9.1,17.6 90 top
R2  6.95,10.4 180 top
R3  7.8,7.65 0 top
R4  4.85,20.25 0 top
R5  3.65,7.65 0 top
R6  5.55,18.7 180 top
R7  25.3,16 90 top
R8  9.85,8.3 270 top
R9  7.6,4 180 top
R10  23.55,15.95 270 top
R11  12.05,16.6 90 top
R12  11,15.1 270 top
R13  20.3,15.75 0 top
R14  13.15,16.6 90 top
R15  24.85,11.35 90 top
R16  26.2,11.35 270 top
R17  46.4,17.1 180 top
R18  17.6,23.4 90 top
R19  5.9,2.3 270 top
R20  31.95,19.4 90 top
R22  47.5,5.55 270 top
R23  46.25,5.55 270 top
U2  22.2,6.65 90 top
U3  38.25,12.7 90 top
U4  46.1,9.45 0 top
U9  6.1,5.8 270 top
U$5  [MH_RND_F_2.2MM_NM]  2.25,2.25 90 top
U$6  [MH_RND_F_2.2MM_NM]  2.25,22.75 90 top
U$7  [MH_RND_F_2.2MM_NM]  59.25,22.75 90 top
U$8  [MH_RND_F_2.2MM_NM]  59.25,2.25 90 top
U$9  18.1,12.4 90 top
USB_ID  5.7,11.65 0 bottom
VUSB  5.7,13.95 0 bottom
Y1  32.45,6.9 90 top

### Tracks (layer width: path | path; a pad name or v marks a point on that pad's centre or on a via)
+3V3  (via drill 0.3, 0.3 pad 0.6)
  Top 0.254: U3.17 C19.1 | C28.1 32.65,11.75 32.95,12.05 | 32.95,12.05 33.85,12.05 33.95,11.95 U3.44 | 32.95,12.05 v32.95,12.3 | 47.4,11.95 47.62,11.72 U4.8 48.8,10.2 49.1,9.9 49.1,5.9 48.3,5.1 R22.2 | 35.3,16.3 35.42,16.3 U3.36
  Top 0.305: 47.98,11.72 v47.95,11.75
  Top 0.406: R23.2 R22.2 | J3.4 48.3,12.1 v47.95,11.75
  Top 0.61: 46.9,11.95 47.4,11.95 47.75,11.95 v47.95,11.75 47.8,11.9 | 46.9,11.95 C19.1 | U2.3 24.05,8.7 24.3,8.95 26,8.95 26.2,9.15 | v33.75,19.65 v36.15,19.65 | C33.1 46.7,12.15 46.9,11.95 | v44.75,18.2 44.75,17.2 44.85,17.1 R17.2 C1.1 | J5.12 27.21,19.59 v27.9,18.9 | R7.2 27.7,16.45 v28.75,15.4 29.7,15.4 | 29.7,15.4 30.25,15.4 v31.2,16.35 35.15,16.35 35.3,16.3 | C29.1 29.8,15.5 29.7,15.4 | R16.2 26.2,10.2 | 26.2,10.2 26.2,9.15 | 26.2,10.2 26.3,10.3 C10.1 v27.3,9.6 | L6.1 26.91,8.44 26.2,9.15
  Bottom 0.406: v47.95,11.75 49.55,11.75 v50.3,11
  Bottom 0.61: 29.27,13.07 28.95,12.75 28.95,10.8 28.43,10.28 J8.1 27.3,10.19 v27.3,9.6 | 29.27,13.07 29.35,13.15 30.9,13.15 31.6,12.45 32.8,12.45 v32.95,12.3 | 29.27,13.07 28.75,13.6 v28.75,15.4 28.75,18.05 v27.9,18.9 | v47.95,11.75 44.75,14.95 v44.75,18.2 43.5,18.2 42.05,19.65 41.1,19.65 40.7,19.25 39.15,19.25 38.75,19.65 v36.15,19.65 | v33.75,19.65 33.7,19.55 31.2,17.05 v31.2,16.35
+5V  (via drill 0.3, 0.3 pad 0.6)
  Top 0.305: U9.1 U9.2 4.35,6.05 4.5,6.3
  Top 0.406: Q5.D2' 15.47,19 Q5.D2 14.2,19 14.1,18.9 | Q2.D2' 15.72,18.15 16.1,18.15 Q2.D2 16.95,18.15 | Q3.G 20.1,12.3 v19.9,12.1 | Q3.A v23.65,11.65
  Top 0.61: 22.55,22.25 J5.14 | 4.05,7 v4.05,6.9 | v4.05,6.9 4.1,6.9 R5.2 C2.1 | v4.05,6.9 4.05,6.55 4.4,6.2 4.5,6.3 | R10.2 v23.55,14.7 | Q2.D2' Q5.D2' | 14.1,18.9 12.38,18.9 J7.1 11.5,21.18 10.72,21.95 9.6,21.95 | v18.6,17.6 18.5,17.6 17.9,18.2 16.15,18.2 16.1,18.15 | R4.2 5.3,21.35 v5.1,21.55 7.4,21.55 7.8,21.95 9.6,21.95 | v9.75,23.9 9.75,22.1 9.6,21.95
  Bottom 0.254: 23.7,11.6 v23.65,11.65 23.55,11.75 | 23.25,12.6 23.55,12.3
  Bottom 0.61: 23.55,11.75 23.55,12.3 v23.55,14.7 23.55,16.9 23.35,17.1 19,17.1 18.6,17.5 v18.6,17.6 | v4.05,6.9 4.05,19.8 5.1,20.85 v5.1,21.55 | v9.75,23.9 20,23.9 21.2,22.7 22.09,22.7 J5.14 | v23.65,11.65 23.65,8.05 23.5,7.9 20.3,7.9 18.9,9.3 18.9,10.8 19.9,11.8 v19.9,12.1
GND  (via drill 0.3 pad 0.6)
  Top 0.254: 44.05,8.7 44,8.65
  other vias: 46.5,11 45.55,12.85 35.75,10.2 33.95,5.55 32.3,9.25 42.1,16.6 29.95,11.55 17.95,9 31.55,4.6 27.65,4.6 19.55,14.9 5.35,10.55 39.2,13.1 8.9,9.9 31.05,20.95 29.1,20.35 10.95,13.7 10.45,16.4 6.5,20.32 7.38,23.62 5.7,6.35 6.5,6.35 6.5,5.25 5.7,5.25 48.3,10.8 33.4,17.15 24.4,17.15 19.85,9.6 19.7,17.95 41.6,18.8 43.35,4.3 47.35,6.9 34.1,18.85 15.7,1.75 18.8,6.05 50.05,14.6 13,7.05 8.55,16.35
  pour Bottom: 0,0 0,25 61.5,25 61.5,0
  pour Top: 0,-0.1 0,24.9 28.5,25 31,25 61.5,25 61.5,0
N17650912  (via drill 0.3 pad 0.6)
  Top 0.305: 5.7,14.6 6.25,14.05 6.2,14.05 D1.4
  Top 0.406: 4.45,13.95 4.28,13.95 J1.1 | v6.5,14.6 5.7,14.6 F2.2
  Top 0.61: D1.4 4.45,13.95
  Bottom 0.406: VUSB.PP 5.85,13.95 v6.5,14.6
N17658775
  Top 0.254: R13.1 19.38,15.75 U$9.6
N17690335  (via drill 0.3)
  Top 0.254: Q2.S2 13.95,18.15 v13.9,18.1 | v16.6,16.3 16.6,16.81 Q2.S1
  Top 0.305: R8.2 10.35,7.85 v10.8,7.4
  Bottom 0.254: v13.9,18.1 14.8,18.1 v16.6,16.3 16,15.7 15.3,15.7 13.3,13.7 13.3,12.3 13.9,11.7 13.9,9.6 12.8,8.5 12.8,7.9 12,7.1 11.1,7.1 v10.8,7.4
N17690346  (via drill 0.3, 0.3 pad 0.6)
  Top 0.254: 11.93,9.8 Q1.D 12.02,9.85 12.85,9.85 13.38,10.38 D2.A v14.6,11.5 | v14.1,13.65 14.1,16.1 13.8,16.4 13.8,17.3 14,17.5 Q2.G2 | Q2.G1 17.2,17.5 v17.4,17.3
  Top 0.305: 11.93,9.8 10.9,9.8 R8.1
  Bottom 0.254: 14.15,13.8 v14.1,13.65 | v14.1,13.65 14.15,13.7 14.15,13.85 15.5,15.2 16.2,15.2 16.5,15.5 16.9,15.5 17.4,16 v17.4,17.3 | v14.6,11.5 14.6,11.8 14.1,12.3 v14.1,13.65
N17690381  (via drill 0.3 pad 0.6)
  Top 0.254: Q1.G v11.5,7.9 | v7.1,18.07 6.62,18.07 R6.1
  Top 0.305: v7.1,18.07 9.1,18.07 R1.2
  Bottom 0.25: 10.7,12.25 9.85,13.1 9.85,14.2 8.7,15.35 7.45,15.35 7.05,15.75
  Bottom 0.254: v11.5,7.9 11.5,9.05 13.15,10.7 13.15,11.2 12.1,12.25 10.7,12.25 | 7.05,15.75 7.05,18.02 v7.1,18.07
N17690821  (via drill 0.3)
  Top 0.254: v14.5,20.8 14.5,20.36 Q5.S1 | Q5.S2 v17.3,19 | R14.2 13.15,17.85 v13.13,17.9
  Bottom 0.254: v14.5,20.8 14,20.8 13.3,20.1 13.3,18.9 | 13.3,18.9 17.2,18.9 v17.3,19 | v13.13,17.9 13.13,18.73 13.3,18.9
N17690840  (via drill 0.3, 0.3 pad 0.6)
  Top 0.254: Q5.G2 17.15,19.65 v17.35,19.85 | Q5.G1 14.05,19.65 v13.95,19.75 13.85,19.85 13.85,20.25 13.45,20.65 v12.35,20.65
  Top 0.305: R1.1 11.05,17.15 v11.05,17.1 | v13.12,15.6 13.15,15.6 13.25,15.5 | 13.25,14.75 13.25,14.53 Q4.D
  Top 0.406: v13.12,15.6 13.1,15.6
  Top 0.61: R14.1 13.12,16.12 v13.12,15.6 | 13.25,15.5 13.25,14.75
  Bottom 0.254: v13.12,15.6 11.7,15.6 11.3,16 11.3,16.85 v11.05,17.1 11.05,17.65 11.3,17.9 11.65,17.9 12.1,18.35 12.1,20.1 v12.35,20.65 | v17.35,19.85 17.2,19.7 13.9,19.7 v13.95,19.75
N17690878
  Top 0.305: 11.98,16.15 R11.1 12.05,15.03 | C15.1 R12.2 11.1,14.75 11.55,14.75 11.83,15.03 12.05,15.03 | 12.05,15.03 Q4.G
N17792230
  Top 0.254: R3.2 8.25,7.25 U9.8
N17798864
  Top 0.254: R5.1 2.85,7.65 2.25,7.05 1.6,7.05 1.35,6.8 DL2.A
N17834267
  Top 0.406: DL1.A 3.05,18.9 R4.1
N17852357  (via drill 0.3 pad 0.6)
  Top 0.254: C30.1 C27.1 U3.6 | L6.2 v28.14,6.84 v28.15,6.85 | v36.6,4.7 37.8,4.7 38,4.9 C30.1 | C30.1
  Bottom 0.254: v28.15,6.85 34.45,6.85 v36.6,4.7
N17852431
  Top 0.254: 34.55,12.45 U3.43 34.05,12.45 34,12.5 33.6,12.5 33.2,12.9 32.3,12.9 C32.1
N$1
  Top 0.305: 6.3,10.2 R2.2
  Top 0.61: J1.11 2.35,15.6 J1.10 J1.9 J1.8 J1.7 2.35,9.4 J1.6 | 4.2,9.2 J1.6 | J1.6 4.35,9.05 C6.1 5.7,9.1 5.7,9.6 6.3,10.2 D1.1
N$2
  Top 0.61: L2.1 F2.1 C4.1
N$3
  Top 0.406: J2.1 12.8,7.9 11.25,6.35 F1.1
N$4  (via drill 0.3 pad 0.6)
  Top 0.254: R15.1 v24.85,9.85
  Bottom 0.254: v24.85,9.85 J8.3
N$5  (via drill 0.3 pad 0.6)
  Top 0.254: U3.41 34.25,13.45 v33.9,13.1
  Bottom 0.254: 34,13.1 v33.9,13.1 34.95,12.05 PA28.PP
N$6  (via drill 0.3 pad 0.6)
  Top 0.254: U3.8 39,8.4 39.45,7.95 39.45,7.05 v39.1,6.7 39.4,7 | v17.5,6.1 17.5,4.7 v15.8,3 | v6.4,3.6 7.05,3.6 7.15,3.5
  Top 0.61: R9.2 7.15,3.5 C13.1 6.05,2.9 R19.1
  Bottom 0.254: v39.1,6.7 37.1,6.7 35.3,8.5 34.7,8.5 34.2,8 27.3,8 26.4,7.1 18.5,7.1 v17.5,6.1 | v15.8,3 10.1,3 9.1,4 8.7,4 8.3,3.6 v6.4,3.6
N$7
  Top 0.305: R18.2 DL3.A
PA00_XIN32
  Top 0.254: C11.2 32.15,8.45 Y1.2 32.95,8.15 34,9.2 35.48,9.2 U3.1
PA01_XOUT32
  Top 0.254: U3.2 36,8.7 35.8,8.5 34.25,8.5 33.95,8.2 33.95,7.25 33.4,6.7 32.7,6.7 32.45,6.45 Y1.1 32.15,5.35 C9.2
PA02_AIN0  (via drill 0.3 pad 0.6)
  Top 0.254: v35,7.85 35.9,7.85 36.5,8.45 U3.3
  Bottom 0.254: J4.2 24.68,2.48 26.95,4.75 26.95,6.75 27.7,7.5 34.8,7.5 35,7.7 v35,7.85
PA03_VREFA
  Top 0.254: U3.4 37,7.9 36.6,7.5 36.15,7.5 35.9,7.25 C12.1 C14.1 35.9,4.7 35.75,4.55 33.75,4.55 33.15,3.95 23.75,3.95 J4.1
PA04_AIN4
  Top 0.254: J4.5 34.05,4.1 37.8,4.1 39.9,6.2 39.9,8.1 39.5,8.5 U3.9
PA05_AIN5
  Top 0.254: J4.6 36.09,3.6 37.9,3.6 40.4,6.1 40.4,8.2 40,8.6 U3.10
PA06_AIN6
  Top 0.254: U3.11 40.5,8.75 40.85,8.4 40.85,5.82 J4.7
PA07_AIN7
  Top 0.254: U3.12 41.3,8.88 41.3,5.5 39.95,4.15 39.95,2.38 J4.8
PA08_S0_I2C_SDA  (via drill 0.3, 0.3 pad 0.6)
  Top 0.25: R23.1 46.25,7.05 | 24.35,19.6 23.3,19.6 22.7,19 19.65,19 v19.4,18.75 | J7.4 v8.5,20.68
  Top 0.254: U3.13 41.77,7.53 42.25,7.05 46.25,7.05 46.55,7.05 47.6,8.1 47.6,8.68 U4.5 | R23.1 45.5,6 45.1,5.6 45.1,4.6 45.5,4.2 55.1,4.2 v55.5,4.6 | v50.85,20.9 51.05,20.7 55.1,20.7 v55.7,20.1 | v36.75,20.85 36.2,20.3 33.35,20.3 v32.75,19.7 | 24.35,19.6 v24.55,19.8
  Bottom 0.25: J5.6 42.45,22.34 | v8.5,20.68 7.42,21.75 ESDA.PP 6.75,21.8 8.15,23.2 15.65,23.2 17.2,21.65 17.95,21.65 19.3,20.3 19.3,18.85 v19.4,18.75
  Bottom 0.254: 42.45,22.34 42.45,22 41.86,21.4 38.45,21.4 37.95,20.9 36.8,20.9 v36.75,20.85 | v50.85,20.9 50.45,21.3 44.65,21.3 43.3,22.65 42.47,22.65 J5.6 | v32.75,19.7 32.55,19.5 29,19.5 28.5,20 24.7,20 24.55,19.85 v24.55,19.8 | v55.7,20.1 56,19.8 56,5.1 v55.5,4.6
PA09_S0_I2C_SCL  (via drill 0.3, 0.3 pad 0.6)
  Top 0.25: R22.1 47.9,6 v48.25,6.35 | 19.2,20 21.3,20 v21.55,20.25
  Top 0.254: U3.14 42.35,10.45 42.5,10.3 42.5,7.95 42.75,7.7 v46.15,7.7 | v49.65,20.4 50,20.05 53.95,20.05 v54.9,19.1 | J5.7 39.91,22.1 40.62,21.4 43.4,21.4 v43.5,21.5 | v33.9,20.9 35.7,20.9 v35.95,21.15 | U4.6 48.2,9.2 48.3,9.1 48.3,7.7 v48.15,7.55 | J7.3 v9.5,20.68 | 19.2,20 v18.65,20
  Bottom 0.25: v48.25,6.35 48.25,7.45 v48.15,7.55 48,7.7 | v18.65,20 18.65,20.15 17.6,21.2
  Bottom 0.254: v46.15,7.7 48,7.7 | v48.25,6.35 48.5,6.1 53.6,6.1 54.9,7.4 v54.9,19.1 | v49.65,20.4 49.65,20.45 49.25,20.85 44.15,20.85 v43.5,21.5 | J5.7 39.1,22.65 37.8,21.35 37.15,21.35 37.05,21.45 36.25,21.45 v35.95,21.15 | v33.9,20.9 32.25,20.9 31.7,20.35 29.95,20.35 29,21.3 27.8,21.3 27.45,20.95 22.25,20.95 v21.55,20.25 | v9.5,20.68 9.5,21.54 ESCL.PP 10.24,22.7 15.4,22.7 16.9,21.2 17.6,21.2
PA10_TCC0-W2  (via drill 0.3 pad 0.6)
  Top 0.254: 47.5,2.38 J4.11 | U3.15 42.75,10.95 43.1,10.6 v43.1,8.7
  Bottom 0.254: v43.1,8.7 43.1,5.5 44.85,3.75 46.12,3.75 J4.11
PA11_TCC0-W3  (via drill 0.3 pad 0.6)
  Top 0.254: U3.16 43.55,11.45 v43.7,11.3 | 50.1,2.37 J4.12
  Bottom 0.254: v43.7,11.3 43.7,5.95 45.4,4.25 48.16,4.25 J4.12
PA12_S2_MOSI
  Top 0.254: 42.25,13.95 U3.21 42.4,13.95 42.8,14.35 46.8,14.35 47.8,14.35 48.95,13.2 J3.3
PA13_S2_SCK  (via drill 0.3)
  Top 0.254: U3.22 42.3,14.45 42.7,14.85 48.05,14.85 49.1,13.8 v51.5,13.8 | v52.4,11 J3.5
  Bottom 0.254: v51.5,13.8 51.8,13.8 52,13.6 52,11.4 v52.4,11
PA14_S2_NSS
  Top 0.254: U3.23 42.2,14.95 42.7,15.45 46.8,15.45 | J3.2 53.2,14.3 52.05,15.45 46.8,15.45 | R17.1 46.85,15.5 46.8,15.45
PA15_S2_MISO  (via drill 0.3, 0.3 pad 0.6)
  Top 0.254: U3.24 41.85,15.45 42.4,16 45.25,16 45.4,16.15 v45.85,16.15 | v53.7,9.9 53.7,9.2 54.1,8.8 J3.7
  Bottom 0.254: v45.85,16.15 45.9,16.2 50.6,16.2 53.7,13.1 v53.7,9.9
PA16_S1_MOSI
  Top 0.254: J5.3 50.08,22.62 47.4,19.95 44.4,19.95 41.45,17 41.45,16.35 41.33,16.23 U3.25
PA17_S1_SCK
  Top 0.254: J5.4 47.53,21.09 46.85,20.4 44.1,20.4 40.5,16.8 U3.26 40.5,16.55
PA18_USB_ID  (via drill 0.3 pad 0.6)
  Top 0.254: U3.27 40,16.95 40.25,17.2 40.25,17.65 v40.35,17.75 | v41.95,5.8 41.95,4.85 v41.15,4.05 | v28.15,5.3 v26.05,5.3 | v11,10.8 11,11.68 D3.A
  Bottom 0.254: v40.35,17.75 40.35,8.15 41.95,6.55 v41.95,5.8 | v28.15,5.3 28.75,5.9 29.8,5.9 30.25,5.45 30.25,4.4 30.8,3.85 40.95,3.85 v41.15,4.05 | v11,10.8 9.75,9.55 9.75,4.05 10.2,3.6 15.4,3.6 17.1,5.3 v26.05,5.3
PA19_S1_MISO
  Top 0.254: J5.5 44.99,21.14 44.7,20.85 40.75,20.85 39.75,19.85 39.75,17.4 39.5,17.15 U3.28
PA20_TCC0-W6  (via drill 0.3 pad 0.6)
  Top 0.254: v39.25,20.3 39.25,17.55 39,17.3 U3.29
  Bottom 0.25: 53.35,19.7 54.5,20.85
  Bottom 0.254: 54.5,20.85 55.15,21.5 J5.1 | 53.35,19.7 52.8,19.15 43.5,19.15 42.3,20.35 40.7,20.35 40.3,19.95 39.6,19.95 v39.25,20.3
PA21_TCC0-W7  (via drill 0.3, 0.3 pad 0.6)
  Top 0.25: v22.7,20.35 21.8,19.45 19.1,19.45 18.75,19.1 v18.2,19.1 | J7.2 v10.5,20.68
  Top 0.254: v36.1,22.15 35.35,21.4 34.25,21.4 34.05,21.6 v33.55,21.6 | v38.4,20.5 38.4,19.8 38.75,19.45 38.75,17.7 38.5,17.45 U3.30 | v30.4,21.35 29.7,20.65 29.7,20 29.4,19.7 28.7,19.7 28.25,20.15 v28.25,20.6 | v22.7,20.35 22.7,20.2
  Bottom 0.25: 51.3,20.3 52.3,21.3 | v10.5,20.68 11.57,21.75 EWK.PP 11.95,21.75 12.45,22.25 15,22.25 16.55,20.7 17.4,20.7 18,20.1 18,19.3 v18.2,19.1
  Bottom 0.254: J5.2 52.62,21.61 52.3,21.3 | 51.3,20.3 50.7,19.7 44.25,19.7 43,20.95 38.85,20.95 v38.4,20.5 | v38.4,20.5 38.45,20.6 | v36.1,22.15 35.35,21.4 35.35,20.45 35.6,20.25 38.15,20.25 v38.4,20.5 | v33.55,21.6 33.4,21.6 33.15,21.35 31.7,21.35 31.35,21.7 30.75,21.7 v30.4,21.35 | v28.25,20.6 28.1,20.45 22.8,20.45 v22.7,20.35
PA22_TC4-W0  (via drill 0.3 pad 0.6)
  Top 0.254: J4.9 42.45,4.64 v42.45,4.5 | U3.31 38,17.75 38.15,17.9 v38.15,18.45
  Bottom 0.254: v38.15,18.45 38.15,11.25 39.7,9.7 39.7,8 40.35,7.35 40.35,6.4 42.25,4.5 v42.45,4.5
PA23_TC4-W1  (via drill 0.3 pad 0.6)
  Top 0.254: U3.32 37.5,18 v37.4,18.1
  Bottom 0.254: J4.10 43.69,3.65 42.4,3.65 39.8,6.25 39.8,7.05 39.2,7.65 39.2,9.35 37.5,11.05 37.5,18 v37.4,18.1
PA27_CD  (via drill 0.3 pad 0.6)
  Top 0.254: v32.4,14.85 32.95,14.3 33.6,14.3 33.75,14.45 U3.39 | v43.3,16.9 43.32,16.88 43.32,18.12 44.7,19.5 48.6,19.5 48.89,19.21 J3.CD1
  Bottom 0.25: 34.65,15.95 34.25,15.55 33,15.55 32.4,14.95 v32.4,14.85 | 38.45,19.05 35.95,19.05 35.2,18.3 35.2,17.85 34.8,17.45
  Bottom 0.254: 34.8,17.45 34.8,16.1 34.65,15.95 | 38.45,19.05 39,18.5 40.6,18.5 41.5,17.6 42.2,17.6 42.23,17.62 42.95,16.9 v43.3,16.9
PA30_SWCLK  (via drill 0.3 pad 0.6)
  Top 0.25: R7.1 v25.3,14.85
  Top 0.254: U3.45 v33.45,11.45 | v25.3,14.85 27.5,14.85 v30,12.35
  Bottom 0.25: v25.3,14.85 J8.4
  Bottom 0.254: v33.45,11.45 30.9,11.45 v30,12.35
PA31_SWDIO  (via drill 0.3 pad 0.6)
  Top 0.254: U3.46 34.1,10.95 33.95,10.8 33.1,10.8 32.95,10.95 28.6,10.95 27.45,12.1 v27.45,13.25
  Bottom 0.254: 27.41,14.7 J8.2 27.39,13.31 v27.45,13.25
PB02_AIN10  (via drill 0.3 pad 0.6)
  Top 0.254: v28.85,4.7 28.85,9.65 29.6,10.4 32.75,10.4 32.85,10.3 34.15,10.3 34.3,10.45 U3.47
  Bottom 0.254: 27.21,2.37 28.85,4 v28.85,4.7
  Bottom 0.305: J4.3 27.21,2.37
PB03_AIN11  (via drill 0.3 pad 0.6)
  Top 0.254: v29.5,5.3 29.5,9.2 30.15,9.85 32.6,9.85 32.75,9.7 34.15,9.7 34.4,9.95 U3.48
  Bottom 0.25: J4.4 29.75,5.04 v29.5,5.3
PB08_LED  (via drill 0.3 pad 0.6)
  Top 0.254: 38.5,8.65 U3.7 38.5,7.9 v38.6,7.8
  Top 0.305: R18.1 16.8,22.95 v16.8,23.05
  Bottom 0.25: 23.6,19.2 21.35,19.2 20.75,19.8
  Bottom 0.254: v38.6,7.8 38.6,9.3 36.85,11.05 36.85,13.35 36.4,13.8 32.7,13.8 32.2,14.3 30.9,14.3 30.6,14.6 30.6,15.2 30.1,15.7 30.1,18.1 29.2,19 28.7,19 28.2,19.5 25.2,19.5 24.9,19.2 23.6,19.2 | 20.75,19.8 20.75,21.75 19.45,23.05 v16.8,23.05
PB10_TCC0-W4  (via drill 0.3 pad 0.6)
  Top 0.254: U3.19 v42.95,12.95
  Bottom 0.254: J4.13 50.1,4.85 46,4.85 44.35,6.5 44.35,11.55 v42.95,12.95
PB11_TCC0-W5  (via drill 0.3 pad 0.6)
  Top 0.254: U3.20 42.55,13.45 42.75,13.65 43.5,13.65 v43.55,13.6
  Bottom 0.254: v43.55,13.6 45.1,12.05 45.1,7.05 46.65,5.5 51.99,5.5 J4.14
PB22_S5_TX  (via drill 0.3 pad 0.6)
  Top 0.254: 34.45,15.45 U3.37 34.48,15.7 32.1,15.7 v31.9,15.5
  Bottom 0.254: J5.9 34.85,22.64 34.85,18.7 34.3,18.15 34.3,16.45 34.05,16.2 32.6,16.2 v31.9,15.5
PB23_S5_RX  (via drill 0.3 pad 0.6)
  Top 0.25: 36.75,20 36.75,18.55 v36.6,18.4
  Top 0.254: v33.35,14.95 U3.38 | J5.8 37.38,20.62 36.75,20
  Bottom 0.25: 36.55,15.25 36.55,18.35 v36.6,18.4
  Bottom 0.254: 36.55,15.25 36.25,14.95 v33.35,14.95
RESET#
  Top 0.254: J5.10 | 32.05,22.41 J5.10 | R20.2 31.95,22.32 J5.10
RESETN  (via drill 0.3 pad 0.6)
  Top 0.25: 31.65,13.75 31.3,13.75 | 31.3,13.75 29.35,13.75 27.5,15.6 26.15,15.6 v26.1,15.55 | 31.2,13.85 31.3,13.75
  Top 0.254: R20.1 C7.1 30.2,18.95 v30.15,18.9 | v26.1,12.7 26.2,12.6 R16.1 R15.2 24.85,12.35 21.45,15.75 R13.2 | U3.40 33.85,13.95 33.65,13.75 31.65,13.75 | v31.2,14.9 31.2,13.85
  Bottom 0.254: v26.1,12.7 v26.1,15.55 | v31.2,14.9 31.2,15.5 30.6,16.1 30.6,18.45 v30.15,18.9
STAT  (via drill 0.3 pad 0.6)
  Top 0.254: v3.55,5 3.55,5.45 DL2.C | U9.5 8.15,5.05 v8.3,4.9
  Bottom 0.254: v3.55,5 4.2,4.35 8.35,4.35 8.4,4.4 8.4,4.9 v8.3,4.9
USB_ID  (via drill 0.3 pad 0.6)
  Top 0.254: J1.4 v5.3,11.85 | v9.4,11.5 D3.C | 12.38,10.88 v12.4,10.85 12.43,10.88 D2.C
  Bottom 0.254: 12.3,10.85 v12.4,10.85 11.45,11.8 9.7,11.8 v9.4,11.5 9.4,11 9.1,10.7 6.45,10.7 v5.3,11.85
  Bottom 0.406: USB_ID.PP 5.3,11.65 v5.3,11.85
USB_N  (via drill 0.3 pad 0.6)
  Top 0.25: 8.15,13.05 4.2,13.05 4.2,13.07 J1.2 | 8.15,13.05 v8.15,13.44 D1.3 | 37,16.5 U3.33 arc90 U3.33 37,16.3 arc90 35.1,18.2 23.3,18.2 arc90 22.2,17.1 arc-90 22.1,17 19.1,17 arc90 18.1,16 arc-90 17.8,15.7 16.5,15.7 arc90 15.2,14.4 15.2,14.1 arc-90 14.15,13.05 8.15,13.05
  Bottom 0.25: D-.PP v8.15,13.44
USB_P  (via drill 0.3 pad 0.6)
  Top 0.25: J1.3 4.2,12.57 4.2,12.65 8.1,12.65 8.15,12.6 | D1.2 v8.15,12.15 8.15,12.6 | 8.15,12.6 14.1,12.6 arc90 15.6,14.1 15.6,14.4 arc-90 16.5,15.3 17.8,15.3 arc90 18.5,16 arc-90 19.1,16.6 22.1,16.6 arc90 22.6,17.1 arc-90 23.3,17.8 26.38,17.8 arc-90 26.59,17.6 26.59,17.55 arc90 26.79,17.35 27.9,17.35 arc90 28.1,17.55 28.1,17.6 arc-90 28.3,17.8 35.1,17.8 arc-90 36.5,16.4 U3.34
  Bottom 0.25: D+.PP v8.15,12.15
VBATT  (via drill 0.3 pad 0.6)
  Top 0.254: Q3.D 21.93,12.95 Q3.D2
  Top 0.305: U9.4 U9.3 4.45,5.35
  Top 0.61: v10.75,4.65 F1.2 9.7,4.5 C3.1 v9,3.25 | v20.55,14.3 21.15,14.3 21.75,13.7 Q3.D2 | 4.45,5.4 4.45,5.35 4.45,4.05 v4.8,3.7 4.8,3.4 5,3.2 5,1.6 5.2,1.4 6,1.4 | 6,1.4 D4.C | R19.2 5.9,1.5 6,1.4
  Bottom 0.61: v10.75,4.65 14.35,4.65 14.8,5.1 14.8,8 | 14.8,8 14.8,10 15.45,10.75 15.45,13.05 16.2,13.7 19.6,13.7 20.2,14.3 v20.55,14.3 | BATT+.PP 14.76,7.96 14.8,8 | 9,2.8 v9,3.25 9,1.6 8.8,1.4 5.4,1.4 5.1,1.7 5.1,3.4 v4.8,3.7
VIN  (via drill 0.3)
  Top 0.254: v15.3,21 15.3,20.48 Q5.D1'
  Top 0.305: R11.2 12.05,17.45 v12.2,17.6
  Top 0.406: Q5.D1 15.78,20.3 Q5.D1'
  Top 0.61: J5.13 24.68,21.88 24,21.2 20.7,21.2 20.3,20.8 16.23,20.8 Q5.D1'
  Bottom 0.254: v12.2,17.6 12.2,17.8 12.6,18.2 12.6,18.7 12.7,18.8 12.7,20.1 13.1,20.5 13.1,20.9 13.6,21.4 14.9,21.4 v15.3,21
VLDO  (via drill 0.3)
  Top 0.254: 21.57,11.65 Q3.K 20.7,11.64 | Q3.S v20.71,13.49 v20.7,13.5 | v20.7,11 20.7,7.2
  Top 0.61: 20.7,7.2 21.25,6.65 U2.2
  Top 0.813: C8.1 U2.2
  Bottom 0.61: v20.7,13.5 v20.7,11
  pour Top: 20.5,11.8 22.2,11.8 22.2,11.3 22.3,11.3 22.6,11 24.2,11 24.2,9.6 23.9,9.3 23.2,8.4 22.9,7.7 23.1,7.1 20.9,7.1 20.5,7.7
VUSB  (via drill 0.3, 0.3 pad 0.6)
  Top 0.406: Q2.D1 15.47,16.85 Q2.D1'
  Top 0.61: v5.2,17.5 5.5,17.5 L2.2 | R6.2 5.1,17.6 v5.2,17.5 | C5.1 v5.2,17.5 | v15.4,16.3 15.4,16.77 Q2.D1'
  Bottom 0.61: v5.2,17.5 5.2,18.9 5.7,19.4 8.7,19.4 9.6,18.5 9.6,15.9 10.8,14.7 13.4,14.7 13.95,15.25 13.95,15.95 14.3,16.3 v15.4,16.3